# EAGLE schematic geiger (EAGLE 8.6.3)
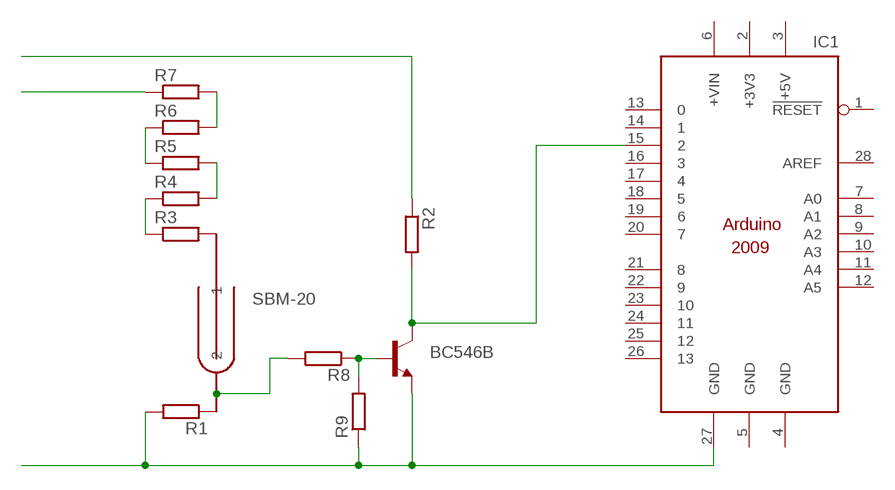
[diagram p0: schematic, sheet 1]

## Parts
IC1  ARDUINO2009_11  [ARDUINO2009_1]
Q1  BC546B  [TO92-EBC]
R1  R-EU_0204/5  [0204/5]
R2  R-EU_0204/5  [0204/5]
R3  R-EU_0204/5  [0204/5]
R4  R-EU_0204/5  [0204/5]
R5  R-EU_0204/5  [0204/5]
R6  R-EU_0204/5  [0204/5]
R7  R-EU_0204/5  [0204/5]
R8  R-EU_0204/5  [0204/5]
R9  R-EU_0204/5  [0204/5]
U$1  SBM-20  [SBM-20]

## Nets
N$1: R1.1 U$1.P$2
N$2: R3.2 U$1.P$1
N$3: R7.1
N$4: R6.2 R7.2
N$5: R5.1 R6.1
N$6: R4.2 R5.2
N$7: R3.1 R4.1
N$8: Q1.B R8.1 R9.2
N$9: IC1.15 Q1.C R2.2
N$10: R2.1
N$11: IC1.27(GND) Q1.E R1.2 R9.1
N$12: R8.2
Unconnected: IC1.1(!RESET) IC1.6(+VIN) IC1.7(A0) IC1.8(A1) IC1.9(A2) IC1.10(A3) IC1.11(A4) IC1.12(A5) IC1.13 IC1.14 IC1.16 IC1.17 IC1.18 IC1.19 IC1.20 IC1.21 IC1.22 IC1.23 IC1.24 IC1.25 IC1.26 IC1.28(AREF)

## Power pins joined to a net without a drawn wire
+3V3: IC1.2(+3V3)
+5V: IC1.3(+5V)
GND: IC1.4(GND) IC1.5(GND)

## Library data of the parts
IC1 = arduino:ARDUINO2009_1: The Arduino Duemilanove ("2009") is a microcontroller board based on the ATmega168 or ATmega328. - 14 digital input/output pins (of which 6 can be used as PWM outputs) - 6 analog inputs, a 16 MHz crystal oscillator - USB connection - power jack - ISP header - reset button It contains everything needed to support the microcontroller; simply connect it to a computer with a USB cable or power it with a AC-to-DC adapter or battery to get started http://arduino.cc/en/Main/ArduinoBoardDuemilanove
Q1 = transistor-npn:BC546*: NPN Transistor
R1-R9 = resistor:R-EU_: RESISTOR, European symbol
U$1 = sbm-20:SBM-20